# EAGLE schematic hearingamp_PAM_v2 (EAGLE 9.6.2)
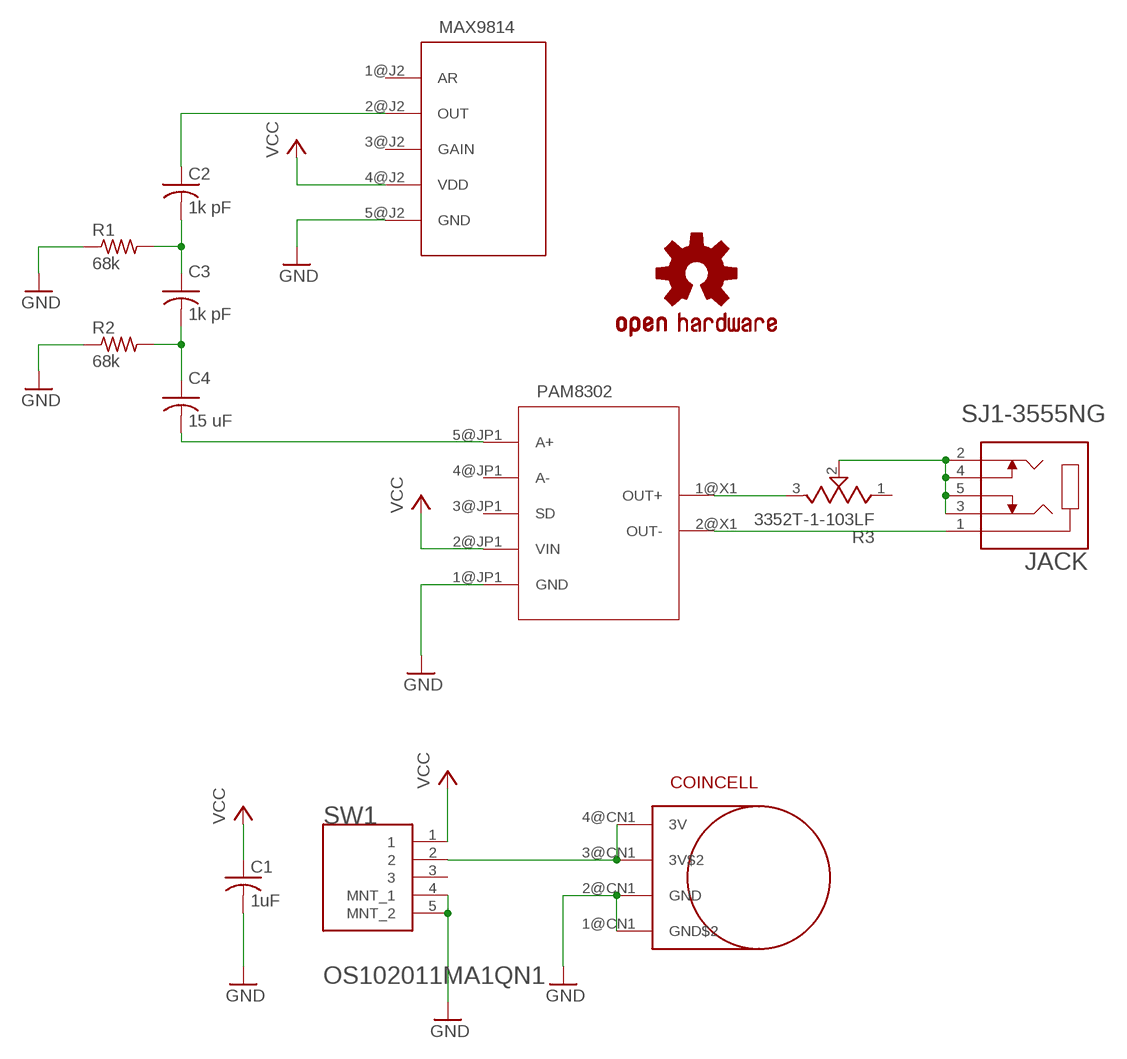
[diagram p0: schematic, sheet 1]

## Parts
C1  1uF  C-US050-025X075  [C050-025X075]
C2  1k pF  C-US050-025X075  [C050-025X075]
C3  1k pF  C-US050-025X075  [C050-025X075]
C4  15 uF  C-US050-025X075  [C050-025X075]
COINCELL  20MMCOINCELL  [CN1_COIN20MM]
JACK  SJ1-3555NG  [CUI_SJ1-3555NG]
LOGO1  OSHW-LOGOL  [OSHW-LOGO-L]
MAX9814  ADAFRUIT_MAX9814  [ADAFRUIT_MAX9814]
PAM1  ADAFRUIT_PAM8302A  [ADAFRUIT_PAM8302]
R1  68k  R-US_0204/7  [0204/7]
R2  68k  R-US_0204/7  [0204/7]
R3  3352T-1-103LF  [TRIM_3352T-1-103LF]
SW1  C&K_OS102011MA1QN1C&K_OS102011MA1QN1_0_0  [C&K_OS102011MA1QN1_0]

## Nets
GND: C1.2 COINCELL.1@CN1(GND$2) COINCELL.2@CN1(GND) MAX9814.5@J2(GND) PAM1.1@JP1(GND) R1.1 R2.1 SW1.4(MNT_1) SW1.5(MNT_2)
N$1: PAM1.1@X1(OUT+) R3.3(CW)
N$2: C3.2 C4.1 R2.2
N$3: JACK.2 JACK.3 JACK.4 JACK.5 R3.2(WIPER)
N$4: COINCELL.3@CN1(3V$2) COINCELL.4@CN1(3V) SW1.2
N$5: C4.2 PAM1.5@JP1(A+)
N$6: C2.2 C3.1 R1.2
N$7: JACK.1 PAM1.2@X1(OUT-)
N$8: C2.1 MAX9814.2@J2(OUT)
VCC: C1.1 MAX9814.4@J2(VDD) PAM1.2@JP1(VIN) SW1.1
Unconnected: MAX9814.1@J2(AR) MAX9814.3@J2(GAIN) PAM1.3@JP1(SD) PAM1.4@JP1(A-) R3.1(CCW) SW1.3

## Notes on the sheet
- PAM8302

## Library data of the parts
C1-C4 = adafruit:C-US: CAPACITOR, American symbol
COINCELL = 20MMCOINCELL:20MMCOINCELL
JACK = SJ1-3555NG:SJ1-3555NG: Audio Jack, 3.5 mm, RT, Stereo, Through Hole, 2 Switches, Isolated Ground Check prices <https://pricing.snapeda.com/parts/SJ1-3555NG/CUI%20Devices/view-part?ref=eda>; AVAILABILITY: In Stock; CUI_PURCHASE_URL: https://www.cuidevices.com/product/interconnect/connectors/audio-connectors/jacks/sj1-355xng-series?utm_source=snapeda.com&utm_medium=referral&utm_campaign=snapedaBOM; DESCRIPTION: 3.5 mm, Stereo, Right Angle, Through Hole, Isolated Ground, Kinked Pins, Audio Jack Connector; MF: CUI Devices; MP: SJ1-3555NG; PACKAGE: None; PRICE: None; PURCHASE-URL: https://pricing.snapeda.com/search/part/SJ1-3555NG/?ref=eda
LOGO1 = SparkFun-Aesthetics:OSHW-LOGO: Open-Source Hardware (OSHW) Logo This logo indicates the piece of hardware it is found on incorporates a OSHW license and/or adheres to the definition of open source hardware found here: http://freedomdefined.org/OSHW
MAX9814 = MAX9814:ADAFRUIT_MAX9814
PAM1 = pam8302:ADAFRUIT_PAM8302A
R1 R2 = adafruit:R-US_: RESISTOR, American symbol
R3 = 3352T-1-102LF:3352T-1-103LF: 10 kOhms 0.5W, 1/2W Through Hole Thumbwheel Potentiometer Top Adjustment Check prices <https://pricing.snapeda.com/parts/3352T-1-103LF/Bourns/view-part?ref=eda>; AVAILABILITY: In Stock; DESCRIPTION: 10 kOhms 0.5W, 1/2W Through Hole Thumbwheel Potentiometer Top Adjustment; MF: Bourns; MP: 3352T-1-103LF; PACKAGE: 2012 Bourns; PRICE: None; PURCHASE-URL: https://pricing.snapeda.com/search/part/3352T-1-103LF/?ref=eda
SW1 = C&K - OS102011MA1QN1:C&K_OS102011MA1QN1: OS Series Miniature Slide Switches; CENTROID_NOT_SPECIFIED: No; DATASHEET: https://www.ckswitches.com/media/1428/os.pdf; DIGIKEY_DESCRIPTION: SWITCH SLIDE SPDT 100MA 12V; DIGIKEY_PART_NUMBER: CKN9559-ND; LEAD_FREE: yes; MF: C&K; MOUSER_PART_NUMBER: OS102011MA1QN1; MPN: OS102011MA1QN1; PACKAGE: SW_SLIDE; PREFIX: SW; ROHS: yes; TEMPERATURE_RANGE_HIGH: +70°C; TEMPERATURE_RANGE_LOW: -30°C